# EAGLE design 808_handclap (EAGLE 7.1.0)
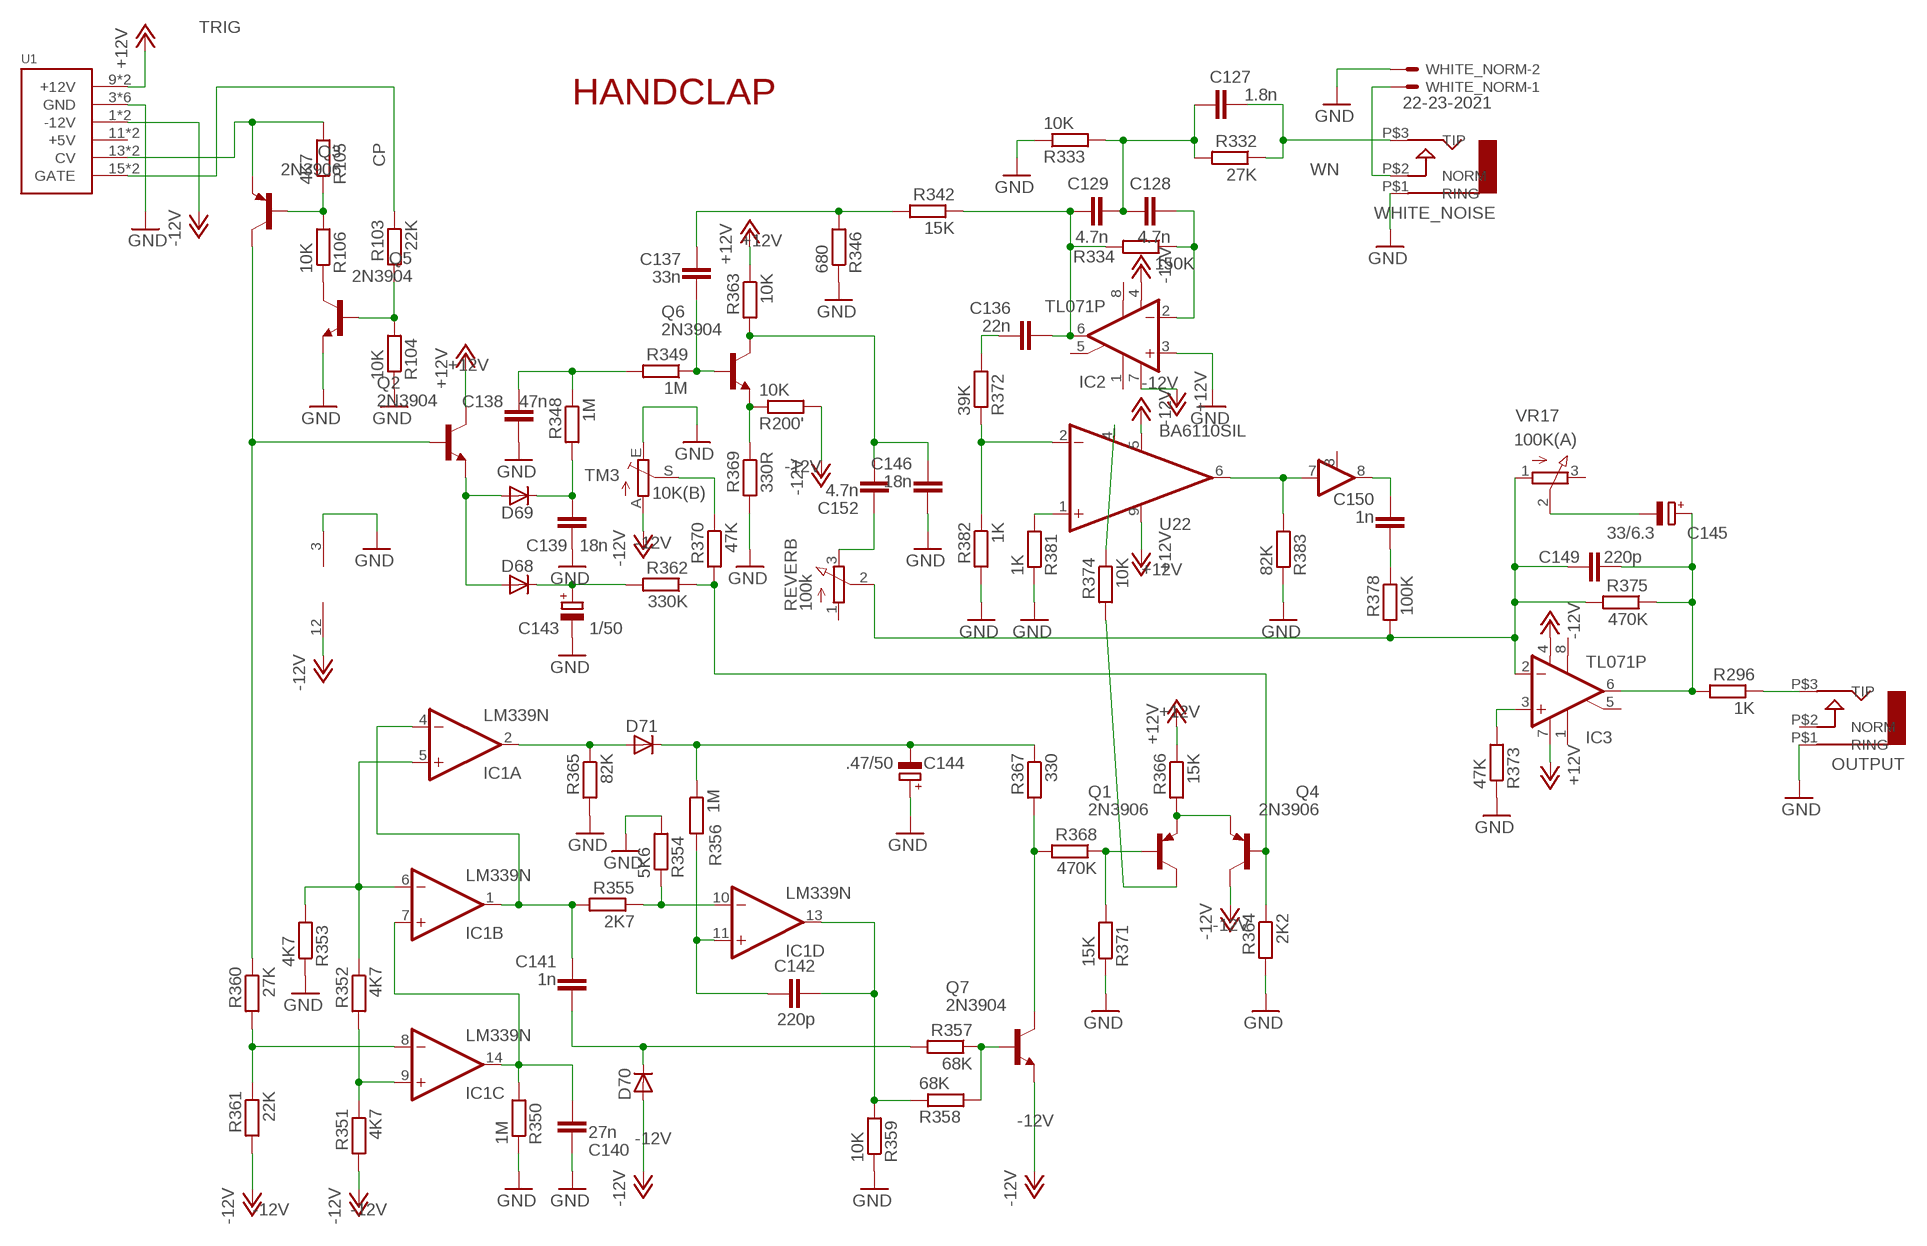
[diagram p0: schematic, sheet 1]

## Parts
C127  1.8n  C-EU075-032X103  [C075-032X103]
C128  4.7n  C-EU3.5MM_PITCH  [C035-025X75]
C129  4.7n  C-EU3.5MM_PITCH  [C035-025X75]
C136  22n  C-EU050-024X044  [C050-024X044]
C137  33n  C-EU075-032X103  [C075-032X103]
C138  47n  C-EU050-024X044  [C050-024X044]
C139  18n  C-EU3.5MM_PITCH  [C035-025X75]
C140  27n  C-EU050-024X044  [C050-024X044]
C141  1n  C-EU3.5MM_PITCH  [C035-025X75]
C142  220p  C-EU050-025X075  [C050-025X075]
C143  1/50  CPOL-EUE2-5  [E2-5]
C144  .47/50  CPOL-EUE2-5  [E2-5]
C145  33/6.3  CPOL-EUE3.5-8  [E3,5-8]
C146  18n  C-EU4MM_PITCH  [C035-030X60]
C149  220p  C-EU050-024X044  [C050-024X044]
C150  1n  C-EU3.5MM_PITCH  [C035-025X75]
C152  4.7n  C-EU3.5MM_PITCH  [C035-025X75]
D68  1N4148DO35-7  [DO35-7]
D69  1N4148DO35-10  [DO35-10]
D70  1N4148DO35-7  [DO35-7]
D71  1N4148DO35-10  [DO35-10]
IC1  LM339N  [DIL14]
IC2  TL071P  [DIL08]
IC3  TL071P  [DIL08]
OUTPUT  AUDIO-JACK  [ERTHENVAR-JACK-90DEG]
Q1  2N3906  [TO92]
Q2  2N3904  [TO92]
Q3  2N3906  [TO92]
Q4  2N3906  [TO92]
Q5  2N3904  [TO92]
Q6  2N3904  [TO92]
Q7  2N3904  [TO92]
R103  22K  R-EU_0207/7  [0207/7]
R104  10K  R-EU_0207/7  [0207/7]
R105  4K7  R-EU_0207/5V  [0207/5V]
R106  10K  R-EU_0207/5V  [0207/5V]
R200'  10K  R-EU_0207/7  [0207/7]
R296  1K  R-EU_0207/7  [0207/7]
R332  27K  R-EU_0207/7  [0207/7]
R333  10K  R-EU_0207/5V  [0207/5V]
R334  150K  R-EU_0207/7  [0207/7]
R342  15K  R-EU_0207/7  [0207/7]
R346  680  R-EU_0207/7  [0207/7]
R348  1M  R-EU_0207/7  [0207/7]
R349  1M  R-EU_0207/5V  [0207/5V]
R350  1M  R-EU_0207/7  [0207/7]
R351  4K7  R-EU_0207/5V  [0207/5V]
R352  4K7  R-EU_0309/10  [0309/10]
R353  4K7  R-EU_0207/7  [0207/7]
R354  5K6  R-EU_0207/5V  [0207/5V]
R355  2K7  R-EU_0207/5V  [0207/5V]
R356  1M  R-EU_0207/7  [0207/7]
R357  68K  R-EU_0207/7  [0207/7]
R358  68K  R-EU_0207/5V  [0207/5V]
R359  10K  R-EU_0207/7  [0207/7]
R360  27K  R-EU_0207/7  [0207/7]
R361  22K  R-EU_0207/2V  [0207/2V]
R362  330K  R-EU_0309/10  [0309/10]
R363  10K  R-EU_0207/7  [0207/7]
R364  2K2  R-EU_0309/10  [0309/10]
R365  82K  R-EU_0207/5V  [0207/5V]
R366  15K  R-EU_0207/7  [0207/7]
R367  330  R-EU_0207/7  [0207/7]
R368  470K  R-EU_0207/7  [0207/7]
R369  330R  R-EU_0207/7  [0207/7]
R370  47K  R-EU_0309/10  [0309/10]
R371  15K  R-EU_0207/7  [0207/7]
R372  39K  R-EU_0207/7  [0207/7]
R373  47K  R-EU_0207/7  [0207/7]
R374  10K  R-EU_0207/7  [0207/7]
R375  470K  R-EU_0207/5V  [0207/5V]
R378  100K  R-EU_0207/7  [0207/7]
R381  1K  R-EU_0207/5V  [0207/5V]
R382  1K  R-EU_0207/5V  [0207/5V]
R383  82K  R-EU_0207/7  [0207/7]
REVERB  100k  3RP/1610N  [3RP/1610N]
TM3  10K(B)  TRIM_1234-S64YW  [S64YW]
U1  POWER  [POWER_16]
U22  BA6110SIL  [SIL09]
VR17  100K(A)  3RP/1610N  [3RP/1610N]
WHITE_NOISE  AUDIO-JACK  [ERTHENVAR-JACK-90DEG]
WHITE_NORM  22-23-2021  [22-23-2021]

## Nets
+12V [Power]: IC2.7(V+) IC3.7(V+) Q2.1(C) R363.1 R366.1 U1.9(+12V) U1.10(+12V) U22.9(V+)
-12V: D70.A IC1.12(P:GND) IC2.4(V-) IC3.4(V-) Q4.1(C) Q7.3(E) R200'.2 R351.2 R361.2 TM3.A U1.1(-12V) U1.2(-12V) U22.5(V-)
CP: R103.1 U1.15(GATE) U1.16(GATE)
GND [GND]: C138.2 C139.P$1 C140.1 C143.- C144.+ C146.P$2 IC1.3(P:V+) IC2.3(+IN) OUTPUT.P$1(RING) Q5.3(E) R104.1 R333.1 R346.1 R350.1 R353.1 R354.2 R359.1 R364.2 R365.2 R369.2 R371.1 R373.1 R381.1 R382.2 R383.1 TM3.E U1.3(GND) U1.4(GND) U1.5(GND) U1.6(GND) U1.7(GND) U1.8(GND) WHITE_NOISE.P$1(RING) WHITE_NORM.2
N$1: OUTPUT.P$3(TIP) R296.1
N$2: WHITE_NOISE.P$2(NORM) WHITE_NORM.1
N$3: Q5.1(C) R106.1
N$4: Q5.2(B) R103.2 R104.2
N$10: C129.P$2 C136.1 IC2.6(OUT) R334.2 R342.1
N$37: Q3.2(B) R105.1 R106.2
N$40: C137.2 Q6.2(B) R349.1
N$41: C139.P$2 D69.C R348.2
N$42: Q6.3(E) R200'.1 R369.1
N$43: Q2.2(B) Q3.1(C) R360.1
N$44: D68.A D69.A Q2.3(E)
N$45: C138.1 R348.1 R349.2
N$46: C146.P$1 C152.P$1 Q6.1(C) R363.2
N$47: C143.+ D68.C R362.2
N$48: Q4.2(B) R362.1 R364.1 R370.2
N$49: R370.1 TM3.S
N$50: C137.1 R342.2 R346.2
N$51: D71.A IC1.2(A:OUT) R365.1
N$52: C127.2 C128.P$2 C129.P$1 R332.2 R333.2
N$54: C128.P$1 IC2.2(-IN) R334.1
N$55: C136.2 R372.2
N$56: R372.1 R382.1 U22.2(-IN)
N$57: C152.P$2 REVERB.3(E)
N$59: R381.2 U22.1(+IN)
N$60: R374.1 U22.4(C)
N$61: R383.2 U22.6(OUT) U22.7(IN1)
N$62: C150.P$2 R378.1
N$63 [special]: C150.P$1 U22.8(OUT1)
N$64: IC1.5(A:+IN) IC1.6(B:-IN) R352.1 R353.2
N$65: C144.- D71.C R356.1 R367.1
N$66: Q1.2(B) R368.1 R371.2
N$67: Q1.3(E) Q4.3(E) R366.2
N$68: C141.P$1 IC1.1(B:OUT) IC1.4(A:-IN) R355.2
N$69: Q1.1(C) R374.2
N$70: Q7.1(C) R367.2 R368.2
N$71: IC1.9(C:+IN) R351.1 R352.2
N$72: C142.2 IC1.11(D:+IN) R356.2
N$73: IC1.10(D:-IN) R354.1 R355.1
N$74: IC1.8(C:-IN) R360.2 R361.1
N$75: Q7.2(B) R357.1 R358.2
N$76: C141.P$2 D70.C R357.2
N$77: C140.2 IC1.7(B:+IN) IC1.14(C:OUT) R350.2
N$78: C142.1 IC1.13(D:OUT) R358.1 R359.2
N$91: IC3.3(+IN) R373.2
N$92 [special]: C149.2 IC3.2(-IN) R375.2 R378.2 REVERB.2(S) VR17.1(A)
N$95: C145.- VR17.2(S)
N$97: C145.+ C149.1 IC3.6(OUT) R296.2 R375.1
TRIG: Q3.3(E) R105.2 U1.13(CV) U1.14(CV)
WN: C127.1 R332.1 WHITE_NOISE.P$3(TIP)
Unconnected: IC2.1(ON1) IC2.5(ON2) IC2.8(OPT) IC3.1(ON1) IC3.5(ON2) IC3.8(OPT) OUTPUT.P$2(NORM) REVERB.1(A) TM3.S@1(S) U1.11(+5V) U1.12(+5V) U22.3 VR17.3(E)

## Notes on the sheet
- HANDCLAP

## Library data of the parts
C127-C129 C136-C142 C146 C149 C150 C152 = TR808clone:C-EU: CAPACITOR, European symbol Pitch 3mm
C143-C145 = TR808clone:CPOL-EU: POLARIZED CAPACITOR, European symbol
D68-D71 = TR808clone:1N4148: DIODE high speed (Philips)
IC1 = linear:LM339: Low Power Low Offset Voltage Quad Comparators with open collector; LM139/LM239/LM339/LM2901/LM3302
IC2 IC3 = 808_lt:TL071: OP AMP
OUTPUT WHITE_NOISE = erthenvar:AUDIO-JACK: Switching Mono 3.5mm Audio Jack from Erthenvar.
Q1 Q3 Q4 = transistor-pnp:2N3906: PNP Transistor
Q2 Q5-Q7 = transistor-npn:2N3904: NPN Transistor
R103-R106 R200' R296 R332-R334 R342 R346 R348-R375 R378 R381-R383 = TR808clone:R-EU_: RESISTOR, European symbol
REVERB VR17 = pot:3RP/1610N: 16mm Potentiometer one level Source: http://www.alphapotentiometers.net/html/16mm_pot_2.html
TM3 = pot:TRIM_1234-: POTENTIOMETER
U1 = eurorack:POWER
U22 = TR808clone:BA6110
WHITE_NORM = con-molex:22-23-2021: .100" (2.54mm) Center Header - 2 Pin; MF: MOLEX; MPN: 22-23-2021; OC_FARNELL: 1462926; OC_NEWARK: 25C3832

## Net classes
0 default: width 0.635 mm, drill 0.254 mm, clearance 0.254 mm
1 GND: width 1.016 mm, drill 1.016 mm, clearance 0.508 mm
2 Power: width 1.016 mm, drill 1.016 mm, clearance 0.508 mm
3 special: width 0.635 mm, drill 0.254 mm, clearance 0.254 mm
4 15v: width 1.524 mm, drill 1.016 mm, clearance 0.508 mm

## Board
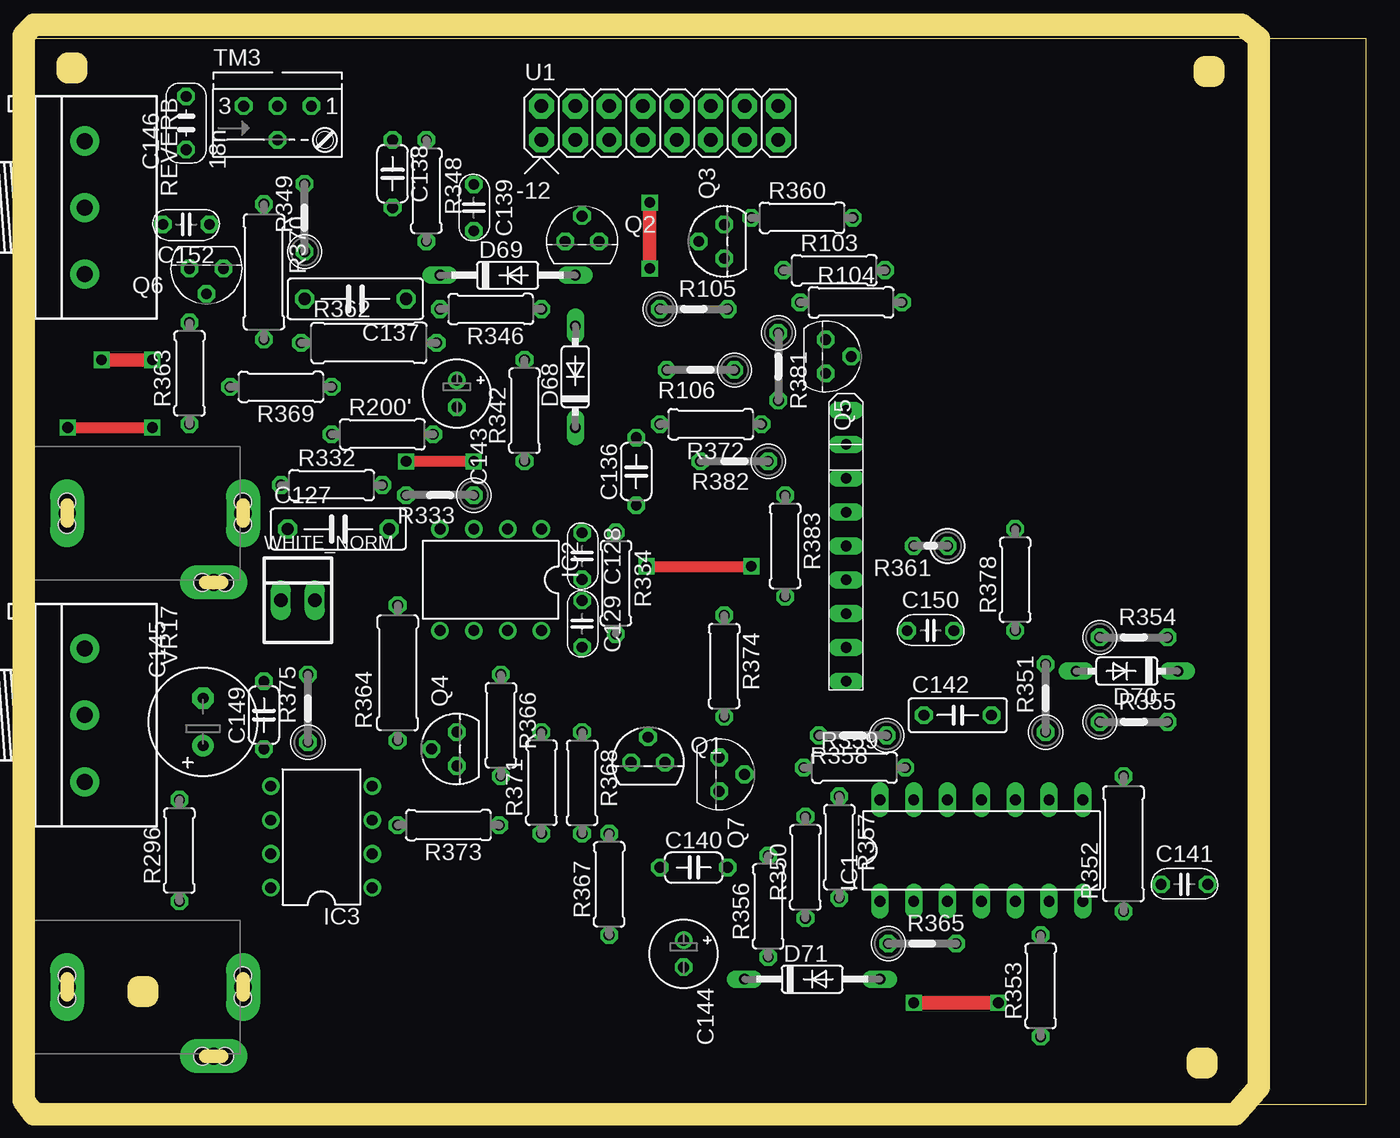
[diagram p1: board, top side]
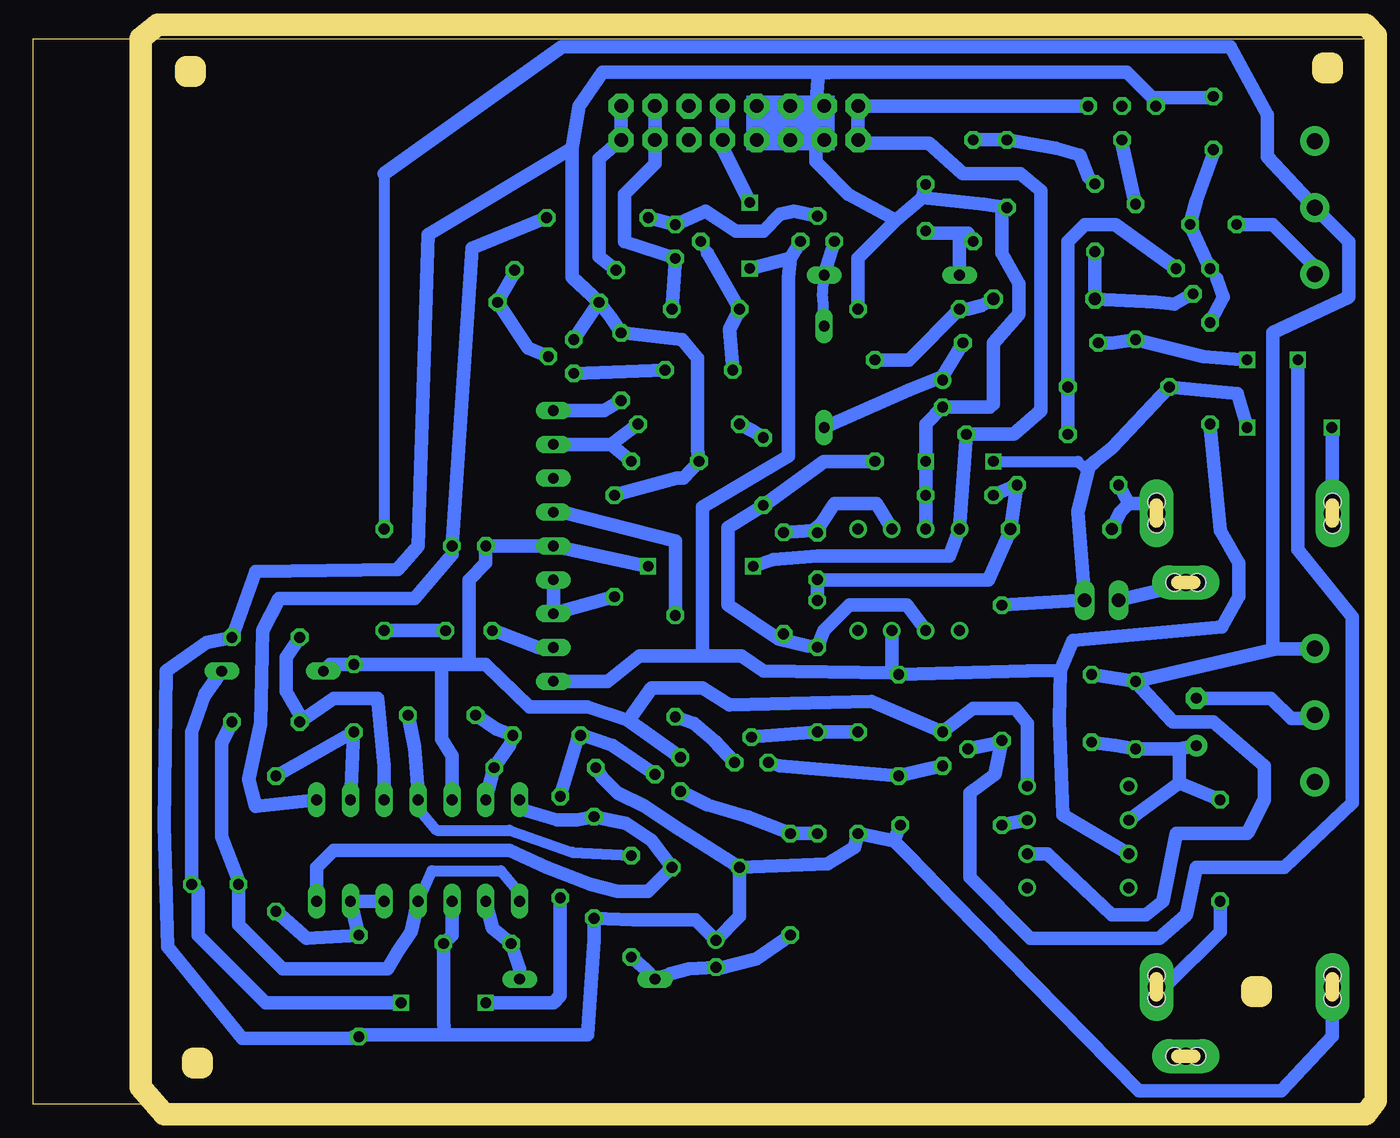
[diagram p2: board, bottom side, seen from below]

Size 100 x 80 mm. Coordinates in mm from the lower left corner, seen from the top.
Outline: 0,0 100,0 100,80 0,80 0,0
Copper layers (1*16): Top 0.035mm / dielectric 1.5mm / Bottom 0.035mm
Design rules "default *": minimum track width 32mil, minimum drill 32mil, track to track 18mil, track to pad 18mil, pad to pad 18mil, via to via 18mil, smd to smd 8mil, copper to edge 0mil, drill to drill 18mil, minimum pad ring 10mil, minimum via ring 8mil, stop-mask expansion 4mil, vias tented up to drill 0mil, thermal gap 10mil
Milling: 24 lines

### Footprints (pad centres in the part's own frame; a part is rotated, then mirrored left to right if it is on the bottom)
C075-032X103 = drill 0.914 octagon: 1 -3.81,0; 2 3.81,0
C035-025X75 = drill 0.8 octagon: P$1 -1.75,0; P$2 1.75,0
C050-024X044 = drill 0.813 octagon: 1 -2.54,0; 2 2.54,0
C050-025X075 = drill 0.813 octagon: 1 -2.54,0; 2 2.54,0
E2-5 = drill 0.813 pad 1.27: + -1.016,0 | drill 0.813 pad 1.27 octagon: - 1.016,0
E3,5-8 = drill 0.813 pad 1.6: + -1.778,0 | drill 0.813 pad 1.6 octagon: - 1.778,0
C035-030X60 = drill 0.8 octagon: P$1 -2,0; P$2 2,0
DO35-7 = drill 0.813 long: A 3.81,0; C -3.81,0
DO35-10 = drill 0.813 long: A 5.08,0; C -5.08,0
DIL14 = drill 0.813 long: 1 -7.62,-3.81; 2 -5.08,-3.81; 3 -2.54,-3.81; 4 0,-3.81; 5 2.54,-3.81; 6 5.08,-3.81; 7 7.62,-3.81; 8 7.62,3.81; 9 5.08,3.81; 10 2.54,3.81; 11 0,3.81; 12 -2.54,3.81; 13 -5.08,3.81; 14 -7.62,3.81
DIL08 = drill 0.813 pad 1.27: 1 -3.81,-3.81; 2 -1.27,-3.81; 3 1.27,-3.81; 4 3.81,-3.81; 5 3.81,3.81; 6 1.27,3.81; 7 -1.27,3.81; 8 -3.81,3.81
ERTHENVAR-JACK-90DEG = drill 1.3 pad 2.54 long: P$1 5,-2.5; P$2 -0.2,-13.5; P$3 5,-15.7 | hole 1.3: 5.842,-2.489; 4.14,-2.489; -0.203,-12.649; -0.203,-14.351; 5.842,-15.697; 4.166,-15.697
TO92 = drill 0.813 octagon: 1 1.27,0; 2 0,1.905; 3 -1.27,0
0207/7 = drill 0.813 octagon: 1 -3.81,0; 2 3.81,0
0207/5V = drill 0.813 octagon: 1 -2.54,0; 2 2.54,0
0309/10 = drill 0.813 octagon: 1 -5.08,0; 2 5.08,0
0207/2V = drill 0.813 octagon: 1 -1.27,0; 2 1.27,0
3RP/1610N = drill 1.2 pad 2.184: 1 -5,0; 2 0,0; 3 5,0
S64YW = drill 0.813 octagon: A 2.54,1.27; E -2.54,1.27; S 0,-1.27; S@1 0,1.27
POWER_16 = drill 1.016 pad 1.88 octagon: 1 -6.35,-1.27; 2 -6.35,1.27; 3 -3.81,-1.27; 4 -3.81,1.27; 5 -1.27,-1.27; 6 -1.27,1.27; 7 1.27,-1.27; 8 1.27,1.27; 9 3.81,-1.27; 10 3.81,1.27; 11 6.35,-1.27; 12 6.35,1.27; 13 8.89,-1.27; 14 8.89,1.27; 15 11.43,-1.27; 16 11.43,1.27
SIL09 = drill 0.8 long: 1 10.16,0; 2 7.62,0; 3 5.08,0; 4 2.54,0; 5 0,0; 6 -2.54,0; 7 -5.08,0; 8 -7.62,0; 9 -10.16,0
22-23-2021 = drill 1 long: 1 -1.27,0; 2 1.27,0

### Placement (x,y rotation side)
C127  22.86,43.18 0 top
C128  41.15,41.15 270 top
C129  41.15,36.07 270 top
C136  45.21,47.5 90 top
C137  24.13,60.45 180 top
C138  26.92,69.85 270 top
C139  33.02,67.31 270 top
C140  49.53,17.78 0 top
C141  86.36,16.51 0 top
C142  69.34,29.21 0 top
C143  31.75,53.34 270 top
C144  48.77,11.3 270 top
C145  12.7,28.7 90 top
C146  11.43,73.66 90 top
C149  17.27,29.21 90 top
C150  67.31,35.56 0 top
C152  11.43,66.04 180 top
D68  40.64,54.61 90 top
D69  35.56,62.23 0 top
D70  82.04,32.51 180 top
D71  58.42,9.4 0 top
IC1  71.12,19.05 0 top
IC2  34.29,39.37 180 top
IC3  21.59,20.07 90 top
OUTPUT  0,3.81 90 top
Q1  46.1,25.65 0 top
Q2  41.15,64.77 0 top
Q3  51.82,64.77 90 top
Q4  31.75,26.67 90 top
Q5  59.44,56.13 270 top
Q6  12.95,62.74 180 top
Q7  51.44,24.77 270 top
R103  60.07,62.61 0 top
R104  61.34,60.2 0 top
R105  49.53,59.69 0 top
R106  50.04,55.12 180 top
R200'  26.16,50.29 0 top
R296  10.92,19.05 90 top
R332  22.35,46.48 0 top
R333  30.48,45.72 180 top
R334  43.69,39.12 270 top
R342  36.83,52.07 90 top
R346  34.29,59.69 180 top
R348  29.46,68.58 270 top
R349  20.32,66.55 90 top
R350  57.91,17.78 90 top
R351  75.95,30.48 90 top
R352  81.79,19.56 90 top
R353  75.56,8.89 90 top
R354  82.55,35.05 0 top
R355  82.55,28.7 0 top
R356  55.12,14.86 90 top
R357  60.45,19.3 270 top
R358  61.47,27.69 180 top
R359  61.59,25.27 0 top
R360  57.66,66.55 0 top
R361  67.31,41.91 180 top
R362  25.15,57.15 0 top
R363  11.68,54.86 90 top
R364  27.3,32.38 90 top
R365  66.67,12.06 0 top
R366  35.05,28.45 270 top
R367  43.18,16.51 90 top
R368  41.15,24.13 270 top
R369  18.54,53.85 180 top
R370  17.27,62.48 270 top
R371  38.1,24.13 90 top
R372  50.8,51.05 180 top
R373  31.11,20.95 180 top
R374  51.82,32.89 270 top
R375  20.57,29.72 90 top
R378  73.66,39.37 90 top
R381  55.88,55.37 270 top
R382  52.58,48.26 180 top
R383  56.39,41.91 270 top
REVERB  3.81,67.31 270 top
TM3  18.29,73.66 0 top
U1  44.45,73.66 0 top
U22  60.96,41.91 90 top
VR17  3.81,29.21 270 top
WHITE_NOISE  0,39.37 90 top
WHITE_NORM  19.81,37.85 0 top

### Tracks (layer width: path | path; a pad name or v marks a point on that pad's centre or on a via)
+12V  (via drill 0.8)
  Top 1.016: v46.23,67.69 v46.23,62.74
  Bottom 1.016: v46.23,67.69 48.26,71.75 U1.9 U1.10 | 49.78,33.66 54.48,33.66 56.9,31.75 U22.9 | 35.56,32.38 34.92,32.38 R366.1 25.4,32.51 22.92,32.58 | 35.56,32.38 45.21,32.51 46.86,33.66 49.78,33.66 | IC3.7 22.73,21.72 22.99,28.83 22.92,32.58 | 35.56,32.38 IC2.7 | R363.1 10.92,43.05 9.53,40.64 9.53,38.1 10.79,35.81 21.97,34.8 22.92,32.58 | 49.78,33.66 49.78,44.83 43.31,48.64 43.31,62.1 43.18,63.5 | v46.23,62.74 43.18,63.5 | 43.18,63.5 Q2.1
-12V  (via drill 0.8)
  Top 0.813: v45.97,40.39 v53.85,40.39
  Bottom 0.813: 68.58,22.23 IC1.12 | 77.72,33.02 D70.A
  Bottom 1.016: 69.34,33.02 R351.2 77.72,33.02 | 69.34,33.02 67.31,33.02 | 67.31,33.02 66.04,33.02 62.74,29.84 58.42,29.84 55.33,28.83 | 67.31,33.02 67.31,39.37 66.04,40.64 R361.2 U22.5 v53.85,40.39 | 55.33,28.83 Q7.3 | TM3.A U1.2 U1.1 37.85,72.14 32.77,72.14 30.23,69.85 25.91,69.85 24.38,68.58 24.38,52.07 26.42,50.29 R200'.2 IC2.4 31.24,41.15 41.15,41.15 44.45,40.89 v45.97,40.39 | IC3.4 25.4,28.57 26.29,29.72 29.46,29.72 Q4.1 37.08,30.23 47.75,29.97 49.78,31.24 53.59,31.24 55.33,28.83 | IC1.12 68.58,26.16 69.34,27.43 69.34,33.02
CP
  Bottom 1.016: R103.1 57.53,63.63 57.53,70.99 U1.15 U1.16
GND  (via drill 0.8)
  Top 0.813: v2.54,50.8 v8.89,50.8 | v33.02,48.26 v27.94,48.26
  Bottom 0.813: 2.5,50.76 v2.54,50.8 | R354.2 85.07,35.05 | 75.18,5.21 R353.1 | v27.94,48.26 21.59,48.26 21.14,47.82 20.77,47.82
  Bottom 1.016: IC1.3 68.58,12.7 R365.2 69.22,6.1 69.09,5.21 | R353.1 75.95,5.08 76.07,4.95 84.33,4.95 89.92,11.81 90.17,20.95 90.04,32.51 87,34.67 85.07,35.05 83.31,40.01 72.64,40.13 71.12,41.91 70.36,65.28 59.56,71.75 | C140.1 40.39,18.03 38.35,19.3 R371.1 35.41,19.78 | 69.09,5.21 58.42,5.21 57.91,12.32 R350.1 54.99,13.84 50.29,13.84 C144.+ 46.99,14.1 C140.1 | R104.1 56.64,59.05 R381.1 51.31,57.4 50.16,56.01 50.16,49.15 R382.2 51.18,46.99 51.69,46.99 R383.1 | R104.1 Q5.3 | R364.2 WHITE_NORM.2 21.59,44.45 20.77,47.82 20.32,48.26 19.05,49.28 R369.2 9.65,53.34 v8.89,50.8 | 33.27,68.07 28.7,67.56 C138.2 27.3,67.31 27.3,63.88 26.04,61.59 26.04,59.31 27.94,57.15 27.94,52.58 28.19,52.32 C143.- 33.02,51.05 v33.02,48.26 R333.1 IC2.3 | R346.1 38.1,63.5 35.24,66.36 | 33.27,68.07 35.24,66.36 | 33.27,68.07 C139.P$1 | C146.P$2 11.43,75.56 15.88,75.56 TM3.E 16,75.56 17.91,77.47 39.37,77.47 | 41.27,72.39 U1.5 U1.7 | 41.27,74.93 U1.6 U1.8 | 41.27,74.93 41.08,77.41 | 41.08,77.41 41.27,77.47 | 41.27,74.93 U1.4 U1.3 41.27,72.39 | 41.27,72.39 41.27,70.74 38.86,68.33 35.24,66.36 | 59.56,71.75 59.05,74.93 57.28,77.47 41.27,77.47 | 59.56,71.75 59.56,62.1 R104.1 | 39.37,77.47 41.27,77.47 | 39.37,77.47 41.08,77.41 | OUTPUT.P$1 2.5,5.12 6.35,1.02 17.02,1.02 30.99,15.24 34.29,18.66 35.41,19.78 | WHITE_NOISE.P$1 2.5,50.76 | R359.1 57.28,24.51 56.13,23.37 54.1,22.35 51.82,20.83 C140.1 | R373.1 35.41,19.78 | 69.09,5.21 75.18,5.21
N$1
  Bottom 0.813: 14.99,8.89 OUTPUT.P$3
  Bottom 1.016: R296.1 10.92,12.95 14.99,8.89
N$2
  Bottom 1.016: WHITE_NORM.1 15.33,38.61 WHITE_NOISE.P$2
N$3
  Bottom 1.016: Q5.1 R106.1
N$4
  Bottom 1.016: Q5.2 62.87,56.77 R104.2 64.01,62.23 R103.2
N$10
  Bottom 0.813: R334.2 44.07,34.92
  Bottom 1.016: R342.1 40.64,48.26 C136.1 47.88,43.31 47.88,37.47 44.07,34.92 41.91,34.42 C129.P$2 40.64,35.56 38.73,37.47 34.42,37.47 IC2.6
N$37
  Bottom 0.813: 49.4,63.88 Q3.2
  Bottom 1.016: R106.2 47.75,58.17 R105.1 49.4,63.88
N$40
  Bottom 1.016: Q6.2 14.35,60.07 15.75,60.2 C137.2 R349.1
N$41
  Bottom 0.813: 33.02,65.41 C139.P$2
  Bottom 1.016: 30.48,65.41 29.84,65.41 R348.2 | 30.48,65.41 33.02,65.41 | 30.48,65.41 D69.C
N$42
  Bottom 1.016: R200'.1 R369.1 22.35,64.77 21.08,66.04 18.8,66.04 Q6.3
N$43
  Bottom 1.016: Q2.2 42.93,67.06 43.94,66.8 45.21,65.53 47.24,65.53 49.53,67.06 Q3.1 R360.1
N$44
  Bottom 0.813: D69.A 40.77,60.58 D68.A
  Bottom 1.016: Q2.3 D69.A
N$45
  Bottom 1.016: R349.2 20.83,69.6 21.46,71.25 23.24,71.75 C138.1 R348.1
N$46
  Bottom 0.813: 11.43,71.37 C146.P$1 | 13.21,66.04 C152.P$1 | Q6.1 11.18,61.98
  Bottom 1.016: Q6.1 13.21,66.04 12.7,67.82 11.43,71.37 | R363.2 10.67,60.58 11.18,61.98
N$47
  Bottom 0.813: 31.75,54.61 C143.+
  Bottom 1.016: R362.2 31.75,54.61 34.29,53.59 D68.C
N$48  (via drill 0.8)
  Top 1.016: v5.08,55.88 v8.89,55.88
  Bottom 0.813: 27.43,27.18 R364.1
  Bottom 1.016: Q4.2 27.43,27.18 | R362.1 19.05,57.15 R370.2 12.19,56.13 v8.89,55.88 | R364.1 27.81,24.77 29.72,23.37 29.72,17.02 25.15,12.45 15.49,12.45 13.46,14.22 12.7,17.78 6.1,17.78 1.02,22.61 1.02,36.58 5.08,41.66 v5.08,55.88
N$49
  Bottom 1.016: R370.1 18.29,72.14 TM3.S
N$50
  Bottom 0.813: R346.2 29.84,59.69
  Bottom 1.016: C137.1 28.83,59.94 29.84,59.69 | R342.2 34.29,55.88 R346.2
N$51
  Bottom 1.016: D71.A 63.5,10.16 R365.1 65.53,13.21 IC1.2
N$52
  Bottom 0.813: 26.67,43.05 26.54,43.18 C127.2 | 40.89,39.37 C128.P$2
  Bottom 1.016: C128.P$2 C129.P$1 | R333.2 R332.2 26.67,43.05 28.32,39.37 40.89,39.37
N$54
  Bottom 1.016: 40.89,43.56 41.53,43.05 R334.1 | IC2.2 36.7,45.09 39.88,45.09 40.89,43.56 | 40.89,43.56 C128.P$1
N$55
  Bottom 1.016: C136.2 45.97,50.55 R372.2
N$56
  Bottom 1.016: 56.64,49.53 U22.2 | R372.1 56.64,49.53 | 56.64,49.53 R382.1
N$57
  Bottom 1.016: C152.P$2 6.99,66.04 3.81,62.87 REVERB.3
N$59
  Bottom 1.016: U22.1 57.15,52.07 R381.2
N$60
  Bottom 0.813: 60.33,44.45 U22.4
  Bottom 1.016: 60.33,44.45 51.82,42.29 R374.1
N$61
  Bottom 1.016: U22.6 U22.7 R383.2
N$62
  Bottom 1.016: R378.1 C150.P$2
N$63
  Bottom 0.813: 65.41,35.56 C150.P$1
  Bottom 1.016: U22.8 62.1,34.29 65.41,35.56
N$64
  Bottom 1.016: IC1.5 IC1.6 R353.2 79.5,12.45 R352.1
N$65
  Bottom 0.813: 48.64,10.16 C144.-
  Bottom 1.016: R367.1 45.72,10.92 48.64,10.16 | C144.- 50.8,10.16 52.2,9.78 D71.C 54.1,10.16 R356.1
N$66
  Bottom 1.016: R371.2 R368.1 Q1.2
N$67
  Bottom 1.016: Q4.3 33.02,25.15 R366.2 43.94,25.4 Q1.3
N$68
  Bottom 0.813: 84.58,16.76 C141.P$1 | IC1.1 63.5,15.88 64.9,17.53 70.1,17.53 IC1.4
  Bottom 1.016: R355.2 85.85,27.18 85.85,20.07 84.58,16.76 84.58,13.46 81.28,10.16 73.41,10.16 72.64,11.43 71.63,12.95 IC1.4
N$69
  Bottom 1.016: Q1.1 48.9,27.3 50.42,28.57 R374.2
N$70
  Bottom 1.016: R368.2 R367.2 46.35,21.59 49.4,22.48 Q7.1
N$71
  Bottom 1.016: IC1.9 R351.1 R352.2
N$72
  Bottom 0.813: R356.2 59.56,18.92 64.26,20.57 69.72,20.57 71.12,22.23 IC1.11 71.12,23.5
  Bottom 1.016: C142.2 71.37,26.8 71.12,23.5
N$73
  Bottom 0.813: R355.1 80.01,29.21
  Bottom 1.016: 80.01,29.21 81.03,30.99 81.03,33.53 R354.1 | R355.1 77.47,30.48 74.17,30.48 73.66,25.4 IC1.10
N$74
  Bottom 0.813: R361.1 68.58,41.27
  Bottom 1.016: R360.2 67.06,64.26 R361.1 | IC1.8 83.31,22.35 83.82,24.38 82.93,28.57 82.8,35.56 81.53,37.97 71.37,37.97 68.58,41.27
N$75
  Bottom 0.813: R358.2 59.05,27.81
  Bottom 1.016: Q7.2 56.52,26.92 59.05,27.81 R357.1
N$76  (via drill 0.8)
  Top 1.016: v66.04,7.62 v72.39,7.62
  Bottom 0.813: 87.63,16.03 C141.P$2
  Bottom 1.016: D70.C 87.12,30.73 88.11,27.97 C141.P$2 | R357.2 60.45,8.13 60.96,7.62 v66.04,7.62 | v72.39,7.62 82.55,7.62 87.63,12.7 87.63,16.03
N$77
  Bottom 0.813: 63.25,22.1 IC1.14
  Bottom 1.016: 63.25,22.1 60.71,21.34 59.18,21.34 R350.2 55.5,21.08 53.59,19.81 C140.2 53.85,16 56.13,16 58.17,16.51 61.47,17.78 64.26,19.05 77.47,19.05 78.74,17.78 IC1.7
N$78
  Bottom 1.016: C142.1 65.28,28.19 R358.1 64.26,26.92 R359.2 IC1.13
N$91
  Bottom 1.016: R373.2 IC3.3
N$92
  Bottom 0.813: 6.99,34.16 6.73,34.16 | 73.66,69.85 R378.2
  Bottom 1.016: 6.73,34.16 C149.2 | 73.66,69.85 60.33,79.38 10.16,79.38 7.37,74.3 7.37,71.12 REVERB.2 1.27,64.77 1.27,60.58 6.99,57.91 6.99,34.16 3.86,34.16 VR17.1 | IC3.2 23.88,18.8 19.05,14.22 16.51,14.22 15.24,15.24 14.22,20.32 8.89,20.32 7.62,22.86 7.62,25.4 11.43,28.7 14.48,28.7 C149.2 | C149.2 R375.2
N$95
  Bottom 0.813: VR17.2 4.06,28.96
  Bottom 1.016: 4.06,28.96 5.59,28.96 7.11,30.48 C145.-
N$97
  Bottom 1.016: 13.97,26.67 13.97,24.13 | 13.97,24.13 R296.2 | 13.97,26.67 C145.+ | 13.97,24.13 IC3.6 | 13.97,26.67 C149.1 18.8,26.92 R375.1
TRIG
  Bottom 1.016: R105.2 Q3.3 55.63,64.77 55.63,68.33 53.34,70.61 U1.13 U1.14
WN
  Bottom 1.016: 17.78,45.09 18.41,44.45 C127.1 | R332.1 17.78,45.09 | 17.78,45.09 16.41,45.09 WHITE_NOISE.P$3
(copper drawn outside any net)
  shapes: Bottom area x1